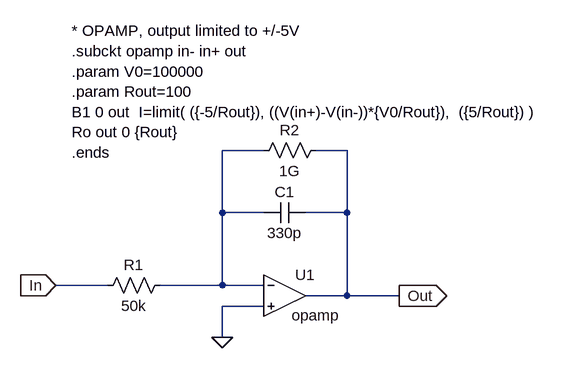
[diagram p0: schematic Ideal_Integrator_mod.asc]
Ideal_Integrator_mod.asc, the LTspice schematic file:
Version 4
SHEET 1 880 680
WIRE 176 -48 112 -48
WIRE 304 -48 256 -48
WIRE 112 48 112 -48
WIRE 176 48 112 48
WIRE 304 48 304 -48
WIRE 304 48 240 48
WIRE -64 160 -144 160
WIRE 112 160 112 48
WIRE 112 160 16 160
WIRE 176 160 112 160
WIRE 304 176 304 48
WIRE 304 176 240 176
WIRE 384 176 304 176
WIRE 176 192 112 192
WIRE 112 240 112 192
FLAG 112 240 0
FLAG 384 176 Out
IOPIN 384 176 Out
FLAG -144 160 In
IOPIN -144 160 In
SYMBOL Opamps\\opamp 208 112 R0
WINDOW 3 11 94 Left 2
SYMATTR InstName U1
SYMBOL cap 240 32 R90
WINDOW 0 0 32 VBottom 2
WINDOW 3 32 32 VTop 2
SYMATTR InstName C1
SYMATTR Value 330p
SYMATTR Value2 ic=0V
SYMBOL res 32 144 R90
WINDOW 0 0 56 VBottom 2
WINDOW 3 32 56 VTop 2
SYMATTR InstName R1
SYMATTR Value 50k
SYMBOL res 272 -64 R90
WINDOW 0 0 56 VBottom 2
WINDOW 3 32 56 VTop 2
SYMATTR InstName R2
SYMATTR Value 1G
TEXT -120 -232 Left 2 !* OPAMP, output limited to +/-5V\n.subckt opamp in- in+ out\n.param V0=100000\n.param Rout=100\nB1 0 out  I=limit( ({-5/Rout}), ((V(in+)-V(in-))*{V0/Rout}),  ({5/Rout}) )\nRo out 0 {Rout}\n.ends

The netlist it stands for:
* Ideal_Integrator_mod.asc
XU1 N001 0 Out opamp Aol=100K GBW=10Meg  ; pins invin noninvin out
C1 Out N001 330p ic=0V
R1 N001 In 50k
R2 Out N001 1G
* OPAMP, output limited to +/-5V
.subckt opamp in- in+ out
.param V0=100000
.param Rout=100
B1 0 out  I=limit( ({-5/Rout}), ((V(in+)-V(in-))*{V0/Rout}),  ({5/Rout}) )
Ro out 0 {Rout}
.ends
.backanno
.end